# Altium schematic sheet ESD7008MUTAG_2026-06-13.schdoc
size 80 x 37 mm
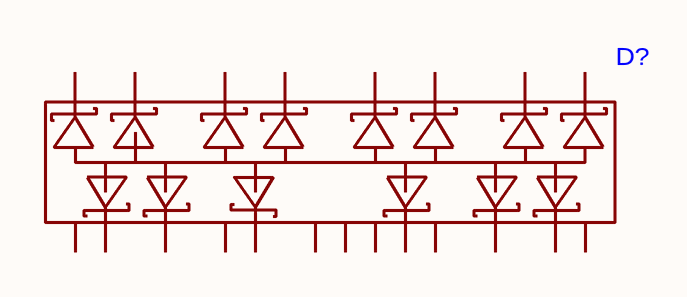
[diagram p0: ESD7008MUTAG_2026-06-13.schdoc]

## Parts
D?  (no value)  [UDFN18_L5.5-W1.5-P0.50-BL]

## Nets

Not connected (* = marked no-connect by the designer): D? 1 2 3 4 5 6 7 8 9 10 11 12 13 14 15 16 17 18 19 20 21

## Library data of the parts
D? = ESD7008MUTAG